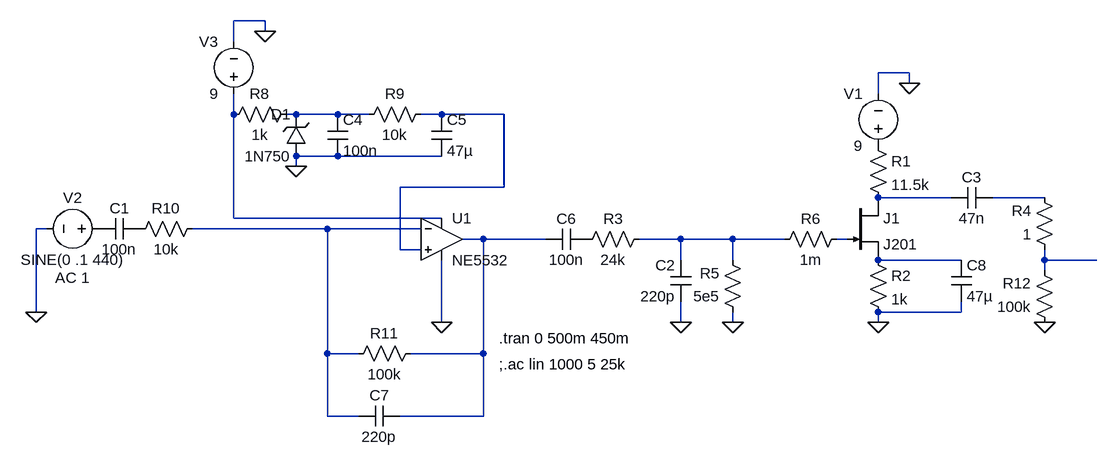
[diagram p0: schematic simulation.asc]
simulation.asc, the LTspice schematic file:
Version 4
SHEET 1 1012 680
WIRE -592 -160 -640 -160
WIRE -592 -144 -592 -160
WIRE -640 -128 -640 -160
WIRE 400 -80 352 -80
WIRE 400 -64 400 -80
WIRE 352 -48 352 -80
WIRE -640 -16 -640 -48
WIRE -544 -16 -560 -16
WIRE -480 -16 -544 -16
WIRE -432 -16 -480 -16
WIRE -320 -16 -352 -16
WIRE -224 -16 -320 -16
WIRE -480 48 -544 48
WIRE -320 48 -480 48
WIRE -544 64 -544 48
WIRE -224 96 -224 -16
WIRE -224 96 -384 96
WIRE 464 112 352 112
WIRE 608 112 528 112
WIRE -640 144 -640 -16
WIRE -320 144 -640 144
WIRE -928 160 -944 160
WIRE -496 160 -704 160
WIRE -352 160 -496 160
WIRE -256 176 -288 176
WIRE -160 176 -256 176
WIRE 48 176 -16 176
WIRE 128 176 48 176
WIRE 208 176 128 176
WIRE 304 176 288 176
WIRE -384 192 -384 96
WIRE -352 192 -384 192
WIRE 48 208 48 176
WIRE 128 208 128 176
WIRE 480 208 352 208
WIRE 608 208 608 192
WIRE 688 208 608 208
WIRE 608 224 608 208
WIRE -944 288 -944 160
WIRE 480 288 480 272
WIRE 480 288 352 288
WIRE -320 304 -320 208
WIRE 48 304 48 272
WIRE 128 304 128 288
WIRE 352 304 352 288
WIRE -496 352 -496 160
WIRE -448 352 -496 352
WIRE -256 352 -256 176
WIRE -256 352 -368 352
WIRE -496 448 -496 352
WIRE -448 448 -496 448
WIRE -256 448 -256 352
WIRE -256 448 -384 448
FLAG 48 304 0
FLAG 352 304 0
FLAG 608 304 0
FLAG 400 -64 0
FLAG 128 304 0
FLAG -944 288 0
FLAG -592 -144 0
FLAG -544 64 0
FLAG -320 304 0
SYMBOL njf 304 112 R0
SYMATTR InstName J1
SYMATTR Value J201
SYMBOL res 336 16 R0
SYMATTR InstName R1
SYMATTR Value 11.5k
SYMBOL res 336 192 R0
SYMATTR InstName R2
SYMATTR Value 1k
SYMBOL res 0 160 R90
WINDOW 0 0 56 VBottom 2
WINDOW 3 32 56 VTop 2
SYMATTR InstName R3
SYMATTR Value 24k
SYMBOL res 624 208 R180
WINDOW 0 36 76 Left 2
WINDOW 3 36 40 Left 2
SYMATTR InstName R4
SYMATTR Value 1
SYMBOL cap -784 144 R90
WINDOW 0 0 32 VBottom 2
WINDOW 3 32 32 VTop 2
SYMATTR InstName C1
SYMATTR Value 100n
SYMBOL cap 64 272 R180
WINDOW 0 24 56 Left 2
WINDOW 3 24 8 Left 2
SYMATTR InstName C2
SYMATTR Value 220p
SYMBOL cap 464 128 R270
WINDOW 0 32 32 VTop 2
WINDOW 3 0 32 VBottom 2
SYMATTR InstName C3
SYMATTR Value 47n
SYMBOL voltage 352 48 R180
WINDOW 0 24 96 Left 2
WINDOW 3 24 16 Left 2
WINDOW 123 0 0 Left 0
WINDOW 39 0 0 Left 0
SYMATTR InstName V1
SYMATTR Value 9
SYMBOL voltage -832 160 R90
WINDOW 0 -32 56 VBottom 2
WINDOW 3 32 56 VTop 2
WINDOW 123 60 56 VTop 2
WINDOW 39 0 0 Left 0
SYMATTR InstName V2
SYMATTR Value SINE(0 .1 440)
SYMATTR Value2 AC 1
SYMBOL res 304 160 R90
WINDOW 0 0 56 VBottom 2
WINDOW 3 32 56 VTop 2
SYMATTR InstName R6
SYMATTR Value 1m
SYMBOL res 144 304 R180
WINDOW 0 36 76 Left 2
WINDOW 3 36 40 Left 2
SYMATTR InstName R5
SYMATTR Value 5e5
SYMBOL ZZZ\\OpAmp\\NE5532 -320 176 R0
SYMATTR InstName U1
SYMBOL voltage -640 -32 R180
WINDOW 0 24 96 Left 2
WINDOW 3 24 16 Left 2
WINDOW 123 0 0 Left 0
WINDOW 39 0 0 Left 0
SYMATTR InstName V3
SYMATTR Value 9
SYMBOL zener -528 48 R180
WINDOW 0 24 64 Left 2
WINDOW 3 24 0 Left 2
SYMATTR InstName D1
SYMATTR Value 1N750
SYMBOL res -544 -32 R90
WINDOW 0 0 56 VBottom 2
WINDOW 3 32 56 VTop 2
SYMATTR InstName R8
SYMATTR Value 1k
SYMBOL res -336 -32 R90
WINDOW 0 0 56 VBottom 2
WINDOW 3 32 56 VTop 2
SYMATTR InstName R9
SYMATTR Value 10k
SYMBOL cap -496 -16 R0
SYMATTR InstName C4
SYMATTR Value 100n
SYMBOL cap -336 -16 R0
SYMATTR InstName C5
SYMATTR Value 47µ
SYMBOL res -688 144 R90
WINDOW 0 0 56 VBottom 2
WINDOW 3 32 56 VTop 2
SYMATTR InstName R10
SYMATTR Value 10k
SYMBOL res -352 336 R90
WINDOW 0 0 56 VBottom 2
WINDOW 3 32 56 VTop 2
SYMATTR InstName R11
SYMATTR Value 100k
SYMBOL cap -96 160 R90
WINDOW 0 0 32 VBottom 2
WINDOW 3 32 32 VTop 2
SYMATTR InstName C6
SYMATTR Value 100n
SYMBOL cap -448 464 R270
WINDOW 0 32 32 VTop 2
WINDOW 3 0 32 VBottom 2
SYMATTR InstName C7
SYMATTR Value 220p
SYMBOL res 624 320 R180
WINDOW 0 36 76 Left 2
WINDOW 3 36 40 Left 2
SYMATTR InstName R12
SYMATTR Value 100k
SYMBOL cap 464 208 R0
SYMATTR InstName C8
SYMATTR Value 47µ
TEXT -232 328 Left 2 !.tran 0 500m 450m
TEXT -232 368 Left 2 !;.ac lin 1000 5 25k

The netlist it stands for:
* simulation.asc
J1 N004 N009 N010 J201
R1 P001 N004 11.5k
R2 N010 0 1k
R3 N008 P002 24k
R4 N011 N005 1
C1 P003 P004 100n
C2 0 N008 220p
C3 N004 N005 47n
V1 P001 0 9
V2 P004 0 SINE(0 .1 440) AC 1
R6 N009 N008 1m
R5 0 N008 5e5
XU1 N003 N006 N001 0 N007 NE5532  ; pins In+ In- V+ V- OUT
V3 N001 0 9
D1 0 N002 1N750
R8 N002 N001 1k
R9 N003 N002 10k
C4 N002 0 100n
C5 N003 0 47µ
R10 N006 P003 10k
R11 N007 N006 100k
C6 P002 N007 100n
C7 N006 N007 220p
R12 0 N011 100k
C8 N010 0 47µ
.model D D
.lib standard.dio
.model NJF NJF
.model PJF PJF
.lib standard.jft
.tran 0 500m 450m
;.ac lin 1000 5 25k
.backanno
.end